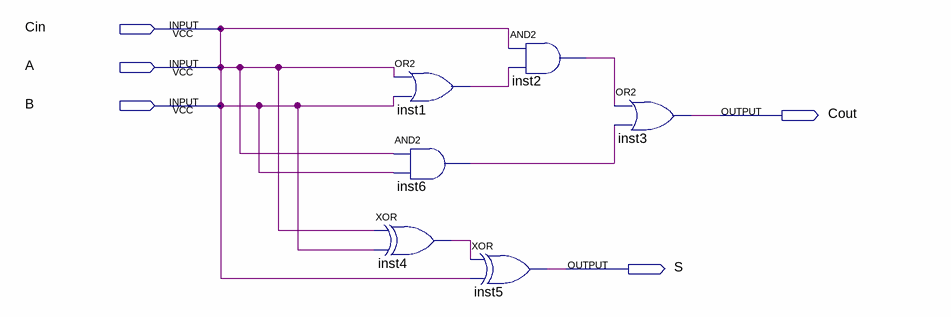
[diagram p0: schematic sheet]
// Quartus schematic AdderDemo.bdf as structural Verilog: 6 symbols, 5 pins
module AdderDemo (
  input  Cin,
  input  A,
  input  B,
  output Cout,
  output S
);

  wire inst1_out, inst2_out, inst4_out, inst6_out;

  or inst1 (inst1_out, A, A);
  and inst6 (inst6_out, A, A);
  xor inst4 (inst4_out, A, A);
  xor inst5 (S, inst4_out, A);
  and inst2 (inst2_out, A, inst1_out);
  or inst3 (Cout, inst2_out, inst6_out);

  assign B = A;
  assign Cin = A;
endmodule
